# Altium schematic sheet relays.SchDoc
size A
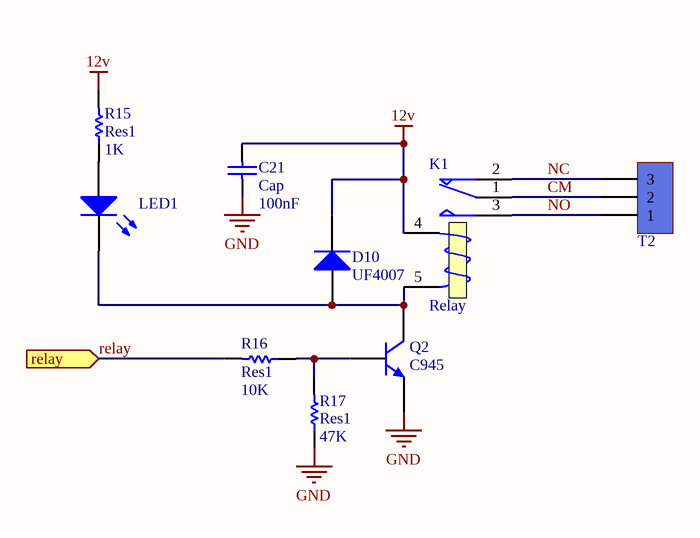
[diagram p0: relays.SchDoc]

## Parts
C21  Cap  value 100nF  [CAP 1206 (3216X15L)]
D10  UF4007  [SMA DIODE 2]
K1  Relay  [Relay 15.40x12.10x13.10]
LED1  LED0  [LED 1206]  (value not drawn)
Q2  C945  [SOT23_N]
R15  Res1  value 1K  [RES 1206 (3216X08L)]
R16  Res1  value 10K  [RES 1206 (3216X08L)]
R17  Res1  value 47K  [RES 1206 (3216X08L)]
T2  Terminal  [Terminal 1*3]  (value not drawn)

## Ports
relay (in)

## Nets
12v: C21.2 D10.2(K) K1.4(T1) R15.2
GND: C21.1 Q2.2(E) R17.1
CM: K1.1(COM) T2.2
NC: K1.2(NC) T2.3
NO: K1.3(NO) T2.1
relay: R16.2 ; port relay
NetD10_1: D10.1(A) K1.5(T2) LED1.2(K) Q2.3(C)
NetLED1_1: LED1.1(A) R15.1
NetQ2_1: Q2.1(B) R16.1 R17.2

## Library data of the parts
C21 = Cap ceramic: CAP-100Nf
D10 = Diode: Default Diode; Published: 8-Jun-2000; LatestRevisionDate: 17-Jul-2002; LatestRevisionNote: Re-released for DXP Platform.; PackageVersion: Sep-1996; PackageReference: SMC; Publisher: Altium Limited; PackageDescription: DO-214-AB/SMC; 2 C-Bend Leads; Body 7.9 x 5.9 mm, inc. leads (LxW); Code_JEDEC: DO-214-AB
K1 = RELAY General: Relay_SPDT POWER NEEDLE; Designer: Ali Hafizi; Company: E.P.I.L; Design_Date: 2011/10/31
LED1 = LED0: Typical INFRARED GaAs LED; Published: 8-Jun-2000; LatestRevisionDate: 08-Jul-2005; LatestRevisionNote: Mech Layer 1 removed.; PackageReference: LED-0; Publisher: Altium Limited; PackageDescription: LED; 2 Leads
Q2 = C945: NPN Silicon Epitaxial Planar Transistor; Published: 2017-2-8; LatestRevisionDate: 2017; LatestRevisionNote: IPC-7351 Footprint Added.; DatasheetVersion: 2017; PackageVersion: 2017-2-8; PackageReference: SOT23; Publisher: Abbas Basereh; PackageDescription: 3-Pin SOT-23 Package 0.95 mm Pitch, 2.3 mm Lead Span; ComponentLink1Description: Manufacturer Link; ComponentLink1URL: http://www.taitroncomponents.com/; ComponentLink2Description: Datasheet; ComponentLink2URL: http://www.taitroncomponents.com/
R15-R17 = Res1: Resistor; Published: 8-Jun-2000; LatestRevisionDate: 17-Jul-2002; LatestRevisionNote: Re-released for DXP Platform.; PackageReference: AXIAL-0.3; Publisher: Altium Limited; PackageDescription: Axial Device, Thru-Hole; 2 Leads; 0.3 in Pin Spacing
T2 = Terminal 1*3: Terminal 3 Pin 250VAC 16A; Designer: Seyed Mohsen Ghasemain; E-mail: picpars@gmail.com; ComponentLinkURL: www.picpars.com